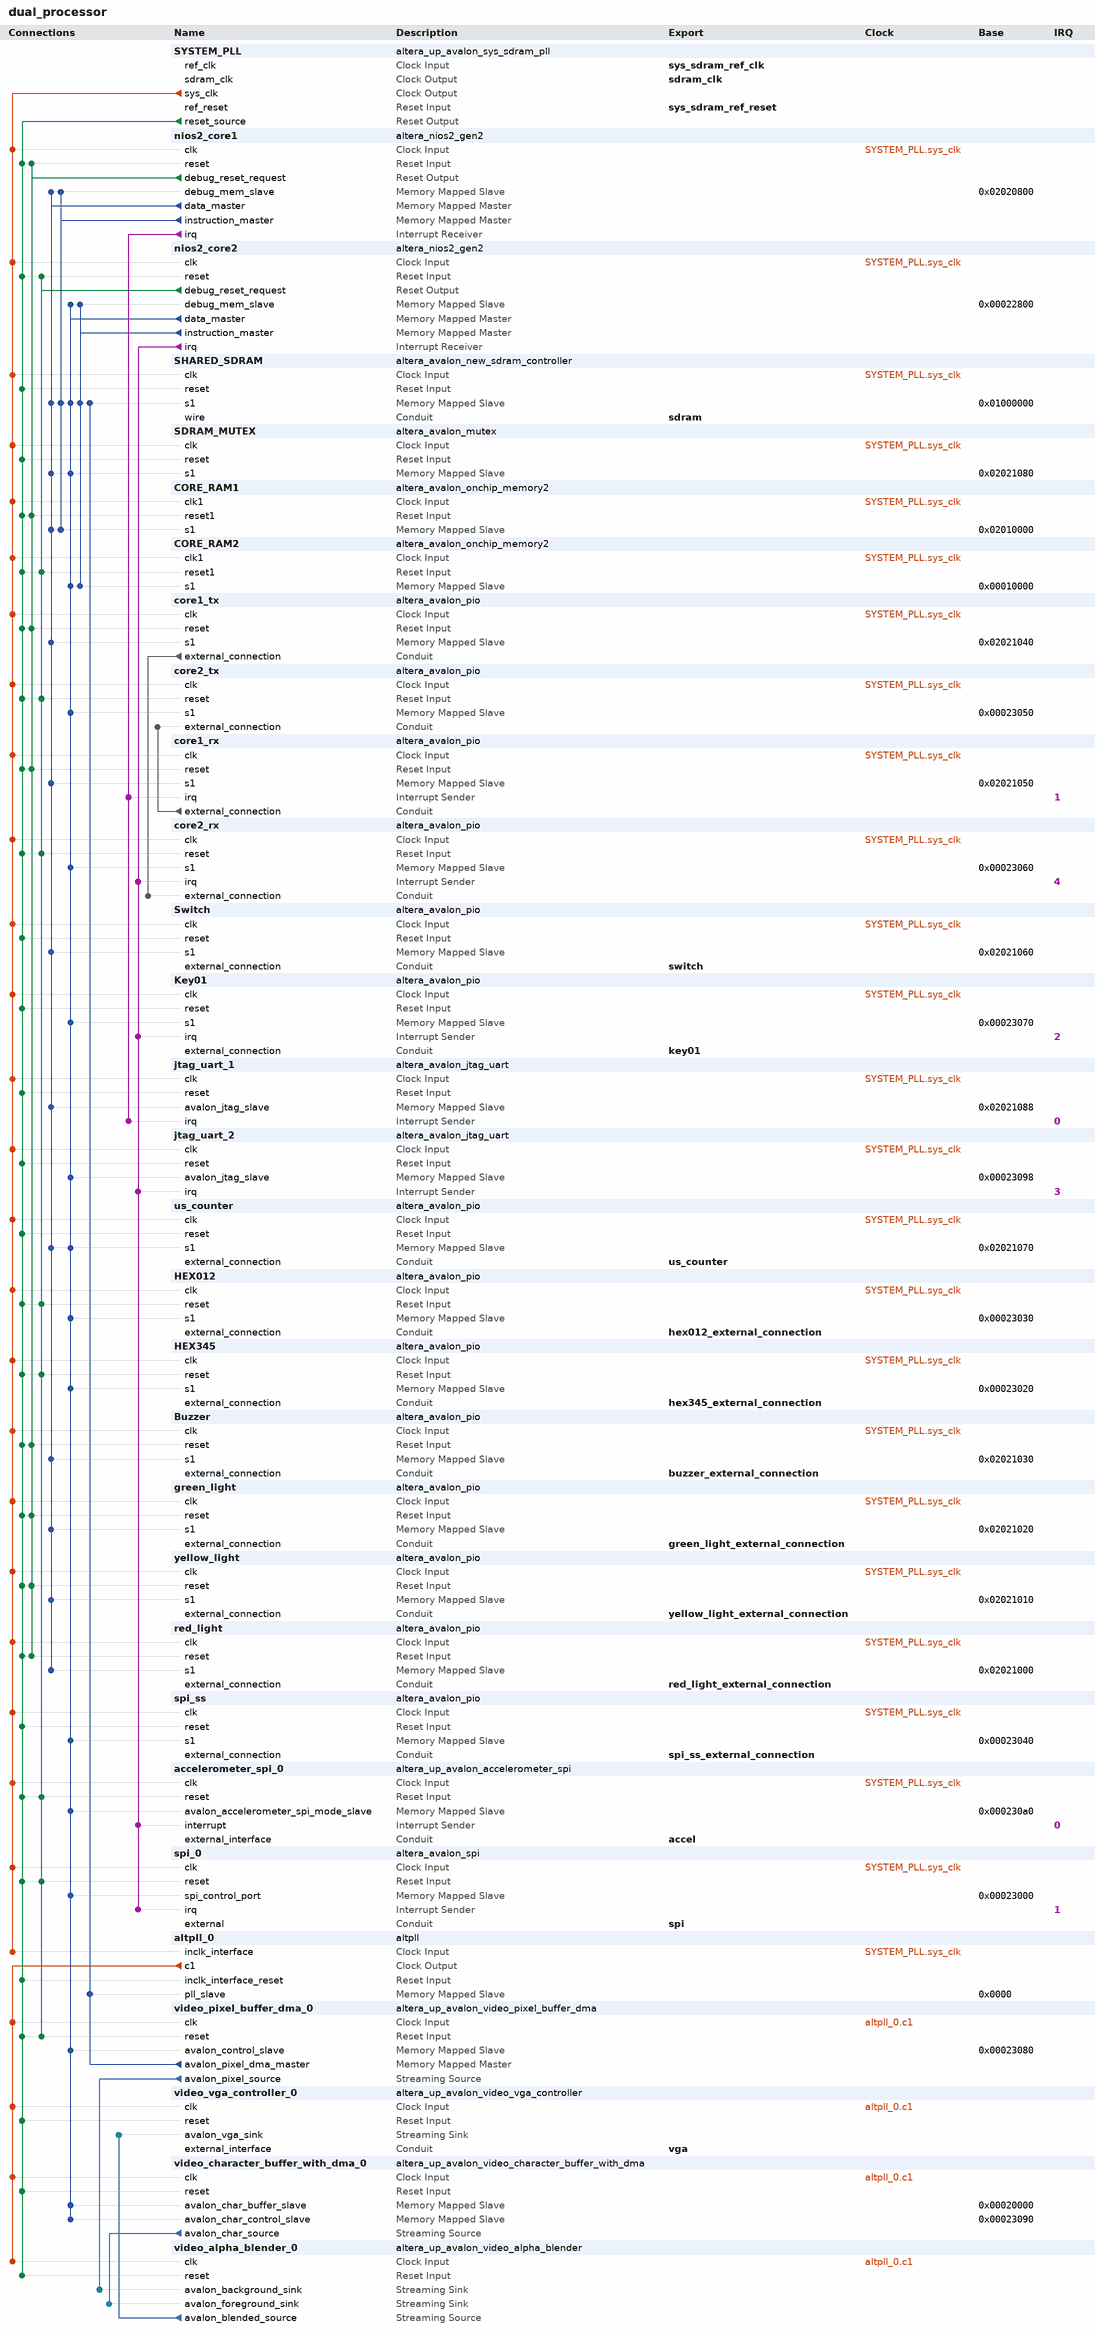
[diagram p0: system contents]
# Platform Designer (Qsys) system dual_processor, MAX 10 10M50DAF484C7G
# Parameters at their usual value, and those the tool derives, are not listed.
package require -exact qsys 18.1
create_system dual_processor
set_project_property DEVICE_FAMILY {MAX 10}
set_project_property DEVICE 10M50DAF484C7G

add_instance SYSTEM_PLL altera_up_avalon_sys_sdram_pll 18.0
set_instance_parameter_value SYSTEM_PLL CV_boards DE10-Standard
set_instance_parameter_value SYSTEM_PLL gui_outclk 50.0
set_instance_parameter_value SYSTEM_PLL gui_refclk 50.0

add_instance nios2_core1 altera_nios2_gen2 18.1
set_instance_parameter_value nios2_core1 dcache_size 2048
set_instance_parameter_value nios2_core1 exceptionSlave CORE_RAM1.s1
set_instance_parameter_value nios2_core1 icache_size 4096
set_instance_parameter_value nios2_core1 impl Fast
set_instance_parameter_value nios2_core1 resetSlave CORE_RAM1.s1

add_instance nios2_core2 altera_nios2_gen2 18.1
set_instance_parameter_value nios2_core2 cpuID 1
set_instance_parameter_value nios2_core2 dcache_size 2048
set_instance_parameter_value nios2_core2 exceptionSlave CORE_RAM2.s1
set_instance_parameter_value nios2_core2 icache_size 4096
set_instance_parameter_value nios2_core2 impl Fast
set_instance_parameter_value nios2_core2 resetSlave CORE_RAM2.s1

add_instance SHARED_SDRAM altera_avalon_new_sdram_controller 18.1
set_instance_parameter_value SHARED_SDRAM TAC 5.5
set_instance_parameter_value SHARED_SDRAM TRCD 20.0
set_instance_parameter_value SHARED_SDRAM TRP 20.0
set_instance_parameter_value SHARED_SDRAM casLatency 3
set_instance_parameter_value SHARED_SDRAM columnWidth 8
set_instance_parameter_value SHARED_SDRAM dataWidth 16
set_instance_parameter_value SHARED_SDRAM generateSimulationModel false
set_instance_parameter_value SHARED_SDRAM model single_Micron_MT48LC4M32B2_7_chip
set_instance_parameter_value SHARED_SDRAM numberOfBanks 4
set_instance_parameter_value SHARED_SDRAM numberOfChipSelects 1
set_instance_parameter_value SHARED_SDRAM powerUpDelay 100.0
set_instance_parameter_value SHARED_SDRAM refreshPeriod 15.625
set_instance_parameter_value SHARED_SDRAM rowWidth 13

add_instance SDRAM_MUTEX altera_avalon_mutex 18.1

add_instance CORE_RAM1 altera_avalon_onchip_memory2 18.1
set_instance_parameter_value CORE_RAM1 dataWidth 32
set_instance_parameter_value CORE_RAM1 dualPort false
set_instance_parameter_value CORE_RAM1 initMemContent true
set_instance_parameter_value CORE_RAM1 initializationFileName onchip_mem.hex
set_instance_parameter_value CORE_RAM1 memorySize 40960

add_instance CORE_RAM2 altera_avalon_onchip_memory2 18.1
set_instance_parameter_value CORE_RAM2 dataWidth 32
set_instance_parameter_value CORE_RAM2 dualPort false
set_instance_parameter_value CORE_RAM2 initMemContent true
set_instance_parameter_value CORE_RAM2 initializationFileName onchip_mem.hex
set_instance_parameter_value CORE_RAM2 memorySize 40960

add_instance core1_tx altera_avalon_pio 18.1
set_instance_parameter_value core1_tx direction Output
set_instance_parameter_value core1_tx width 1

add_instance core2_tx altera_avalon_pio 18.1
set_instance_parameter_value core2_tx direction Output
set_instance_parameter_value core2_tx width 1

add_instance core1_rx altera_avalon_pio 18.1
set_instance_parameter_value core1_rx direction Input
set_instance_parameter_value core1_rx generateIRQ true
set_instance_parameter_value core1_rx width 1

add_instance core2_rx altera_avalon_pio 18.1
set_instance_parameter_value core2_rx direction Input
set_instance_parameter_value core2_rx generateIRQ true
set_instance_parameter_value core2_rx width 1

add_instance Switch altera_avalon_pio 18.1
set_instance_parameter_value Switch direction Input
set_instance_parameter_value Switch width 10

add_instance Key01 altera_avalon_pio 18.1
set_instance_parameter_value Key01 direction Input
set_instance_parameter_value Key01 generateIRQ true
set_instance_parameter_value Key01 width 2

add_instance jtag_uart_1 altera_avalon_jtag_uart 18.1
set_instance_parameter_value jtag_uart_1 simInteractiveOptions NO_INTERACTIVE_WINDOWS

add_instance jtag_uart_2 altera_avalon_jtag_uart 18.1
set_instance_parameter_value jtag_uart_2 simInteractiveOptions NO_INTERACTIVE_WINDOWS

add_instance us_counter altera_avalon_pio 18.1
set_instance_parameter_value us_counter direction Input
set_instance_parameter_value us_counter width 32

add_instance HEX012 altera_avalon_pio 18.1
set_instance_parameter_value HEX012 direction Output
set_instance_parameter_value HEX012 width 24

add_instance HEX345 altera_avalon_pio 18.1
set_instance_parameter_value HEX345 direction Output
set_instance_parameter_value HEX345 width 24

add_instance Buzzer altera_avalon_pio 18.1
set_instance_parameter_value Buzzer direction Output
set_instance_parameter_value Buzzer width 1

add_instance green_light altera_avalon_pio 18.1
set_instance_parameter_value green_light direction Output
set_instance_parameter_value green_light width 1

add_instance yellow_light altera_avalon_pio 18.1
set_instance_parameter_value yellow_light direction Output
set_instance_parameter_value yellow_light width 1

add_instance red_light altera_avalon_pio 18.1
set_instance_parameter_value red_light direction Output
set_instance_parameter_value red_light width 1

add_instance spi_ss altera_avalon_pio 18.1
set_instance_parameter_value spi_ss direction Output
set_instance_parameter_value spi_ss width 1

add_instance accelerometer_spi_0 altera_up_avalon_accelerometer_spi 18.0

add_instance spi_0 altera_avalon_spi 18.1
set_instance_parameter_value spi_0 clockPolarity 0
set_instance_parameter_value spi_0 dataWidth 8
set_instance_parameter_value spi_0 masterSPI true
set_instance_parameter_value spi_0 numberOfSlaves 1
set_instance_parameter_value spi_0 targetClockRate 128000

add_instance altpll_0 altpll 18.1
set_instance_parameter_value altpll_0 CLK0_DIVIDE_BY 1
set_instance_parameter_value altpll_0 CLK0_MULTIPLY_BY 1
set_instance_parameter_value altpll_0 CLK1_DIVIDE_BY 4
set_instance_parameter_value altpll_0 CLK1_DUTY_CYCLE 50
set_instance_parameter_value altpll_0 CLK1_MULTIPLY_BY 1
set_instance_parameter_value altpll_0 CLK1_PHASE_SHIFT 0
set_instance_parameter_value altpll_0 INCLK0_INPUT_FREQUENCY 10000
set_instance_parameter_value altpll_0 PORT_ARESET PORT_UNUSED
set_instance_parameter_value altpll_0 PORT_LOCKED PORT_UNUSED
set_instance_parameter_value altpll_0 PORT_clk1 PORT_USED
set_instance_parameter_value altpll_0 PORT_clk2 PORT_UNUSED
set_instance_parameter_value altpll_0 PORT_clk3 PORT_UNUSED

add_instance video_pixel_buffer_dma_0 altera_up_avalon_video_pixel_buffer_dma 18.0
set_instance_parameter_value video_pixel_buffer_dma_0 addr_mode X-Y
set_instance_parameter_value video_pixel_buffer_dma_0 back_start_address 0
set_instance_parameter_value video_pixel_buffer_dma_0 color_space {30-bit RGB}
set_instance_parameter_value video_pixel_buffer_dma_0 image_height 480
set_instance_parameter_value video_pixel_buffer_dma_0 image_width 640
set_instance_parameter_value video_pixel_buffer_dma_0 start_address 0

add_instance video_vga_controller_0 altera_up_avalon_video_vga_controller 18.1
set_instance_parameter_value video_vga_controller_0 board DE10-Lite
set_instance_parameter_value video_vga_controller_0 resolution {VGA 640x480}

add_instance video_character_buffer_with_dma_0 altera_up_avalon_video_character_buffer_with_dma 18.0
set_instance_parameter_value video_character_buffer_with_dma_0 enable_transparency true

add_instance video_alpha_blender_0 altera_up_avalon_video_alpha_blender 18.0

# connections
add_connection altpll_0.c1 video_alpha_blender_0.clk clock
add_connection altpll_0.c1 video_character_buffer_with_dma_0.clk clock
add_connection altpll_0.c1 video_pixel_buffer_dma_0.clk clock
add_connection altpll_0.c1 video_vga_controller_0.clk clock
add_connection SYSTEM_PLL.sys_clk accelerometer_spi_0.clk clock
add_connection SYSTEM_PLL.sys_clk altpll_0.inclk_interface clock
add_connection SYSTEM_PLL.sys_clk Buzzer.clk clock
add_connection SYSTEM_PLL.sys_clk core1_rx.clk clock
add_connection SYSTEM_PLL.sys_clk core1_tx.clk clock
add_connection SYSTEM_PLL.sys_clk core2_rx.clk clock
add_connection SYSTEM_PLL.sys_clk core2_tx.clk clock
add_connection SYSTEM_PLL.sys_clk CORE_RAM1.clk1 clock
add_connection SYSTEM_PLL.sys_clk CORE_RAM2.clk1 clock
add_connection SYSTEM_PLL.sys_clk green_light.clk clock
add_connection SYSTEM_PLL.sys_clk HEX012.clk clock
add_connection SYSTEM_PLL.sys_clk HEX345.clk clock
add_connection SYSTEM_PLL.sys_clk jtag_uart_1.clk clock
add_connection SYSTEM_PLL.sys_clk jtag_uart_2.clk clock
add_connection SYSTEM_PLL.sys_clk Key01.clk clock
add_connection SYSTEM_PLL.sys_clk nios2_core1.clk clock
add_connection SYSTEM_PLL.sys_clk nios2_core2.clk clock
add_connection SYSTEM_PLL.sys_clk red_light.clk clock
add_connection SYSTEM_PLL.sys_clk SDRAM_MUTEX.clk clock
add_connection SYSTEM_PLL.sys_clk SHARED_SDRAM.clk clock
add_connection SYSTEM_PLL.sys_clk spi_0.clk clock
add_connection SYSTEM_PLL.sys_clk spi_ss.clk clock
add_connection SYSTEM_PLL.sys_clk Switch.clk clock
add_connection SYSTEM_PLL.sys_clk us_counter.clk clock
add_connection SYSTEM_PLL.sys_clk yellow_light.clk clock
add_connection nios2_core1.debug_reset_request Buzzer.reset reset
add_connection nios2_core1.debug_reset_request core1_rx.reset reset
add_connection nios2_core1.debug_reset_request core1_tx.reset reset
add_connection nios2_core1.debug_reset_request CORE_RAM1.reset1 reset
add_connection nios2_core1.debug_reset_request green_light.reset reset
add_connection nios2_core1.debug_reset_request nios2_core1.reset reset
add_connection nios2_core1.debug_reset_request red_light.reset reset
add_connection nios2_core1.debug_reset_request yellow_light.reset reset
add_connection nios2_core2.debug_reset_request accelerometer_spi_0.reset reset
add_connection nios2_core2.debug_reset_request core2_rx.reset reset
add_connection nios2_core2.debug_reset_request core2_tx.reset reset
add_connection nios2_core2.debug_reset_request CORE_RAM2.reset1 reset
add_connection nios2_core2.debug_reset_request HEX012.reset reset
add_connection nios2_core2.debug_reset_request HEX345.reset reset
add_connection nios2_core2.debug_reset_request nios2_core2.reset reset
add_connection nios2_core2.debug_reset_request spi_0.reset reset
add_connection nios2_core2.debug_reset_request video_pixel_buffer_dma_0.reset reset
add_connection SYSTEM_PLL.reset_source accelerometer_spi_0.reset reset
add_connection SYSTEM_PLL.reset_source altpll_0.inclk_interface_reset reset
add_connection SYSTEM_PLL.reset_source Buzzer.reset reset
add_connection SYSTEM_PLL.reset_source core1_rx.reset reset
add_connection SYSTEM_PLL.reset_source core1_tx.reset reset
add_connection SYSTEM_PLL.reset_source core2_rx.reset reset
add_connection SYSTEM_PLL.reset_source core2_tx.reset reset
add_connection SYSTEM_PLL.reset_source CORE_RAM1.reset1 reset
add_connection SYSTEM_PLL.reset_source CORE_RAM2.reset1 reset
add_connection SYSTEM_PLL.reset_source green_light.reset reset
add_connection SYSTEM_PLL.reset_source HEX012.reset reset
add_connection SYSTEM_PLL.reset_source HEX345.reset reset
add_connection SYSTEM_PLL.reset_source jtag_uart_1.reset reset
add_connection SYSTEM_PLL.reset_source jtag_uart_2.reset reset
add_connection SYSTEM_PLL.reset_source Key01.reset reset
add_connection SYSTEM_PLL.reset_source nios2_core1.reset reset
add_connection SYSTEM_PLL.reset_source nios2_core2.reset reset
add_connection SYSTEM_PLL.reset_source red_light.reset reset
add_connection SYSTEM_PLL.reset_source SDRAM_MUTEX.reset reset
add_connection SYSTEM_PLL.reset_source SHARED_SDRAM.reset reset
add_connection SYSTEM_PLL.reset_source spi_0.reset reset
add_connection SYSTEM_PLL.reset_source spi_ss.reset reset
add_connection SYSTEM_PLL.reset_source Switch.reset reset
add_connection SYSTEM_PLL.reset_source us_counter.reset reset
add_connection SYSTEM_PLL.reset_source video_alpha_blender_0.reset reset
add_connection SYSTEM_PLL.reset_source video_character_buffer_with_dma_0.reset reset
add_connection SYSTEM_PLL.reset_source video_pixel_buffer_dma_0.reset reset
add_connection SYSTEM_PLL.reset_source video_vga_controller_0.reset reset
add_connection SYSTEM_PLL.reset_source yellow_light.reset reset
add_connection nios2_core1.data_master Buzzer.s1 avalon
set_connection_parameter_value nios2_core1.data_master/Buzzer.s1 baseAddress 0x02021030
add_connection nios2_core1.data_master core1_rx.s1 avalon
set_connection_parameter_value nios2_core1.data_master/core1_rx.s1 baseAddress 0x02021050
add_connection nios2_core1.data_master core1_tx.s1 avalon
set_connection_parameter_value nios2_core1.data_master/core1_tx.s1 baseAddress 0x02021040
add_connection nios2_core1.data_master CORE_RAM1.s1 avalon
set_connection_parameter_value nios2_core1.data_master/CORE_RAM1.s1 baseAddress 0x02010000
add_connection nios2_core1.data_master green_light.s1 avalon
set_connection_parameter_value nios2_core1.data_master/green_light.s1 baseAddress 0x02021020
add_connection nios2_core1.data_master jtag_uart_1.avalon_jtag_slave avalon
set_connection_parameter_value nios2_core1.data_master/jtag_uart_1.avalon_jtag_slave baseAddress 0x02021088
add_connection nios2_core1.data_master nios2_core1.debug_mem_slave avalon
set_connection_parameter_value nios2_core1.data_master/nios2_core1.debug_mem_slave baseAddress 0x02020800
add_connection nios2_core1.data_master red_light.s1 avalon
set_connection_parameter_value nios2_core1.data_master/red_light.s1 baseAddress 0x02021000
add_connection nios2_core1.data_master SDRAM_MUTEX.s1 avalon
set_connection_parameter_value nios2_core1.data_master/SDRAM_MUTEX.s1 baseAddress 0x02021080
add_connection nios2_core1.data_master SHARED_SDRAM.s1 avalon
set_connection_parameter_value nios2_core1.data_master/SHARED_SDRAM.s1 baseAddress 0x01000000
add_connection nios2_core1.data_master Switch.s1 avalon
set_connection_parameter_value nios2_core1.data_master/Switch.s1 baseAddress 0x02021060
add_connection nios2_core1.data_master us_counter.s1 avalon
set_connection_parameter_value nios2_core1.data_master/us_counter.s1 baseAddress 0x02021070
add_connection nios2_core1.data_master yellow_light.s1 avalon
set_connection_parameter_value nios2_core1.data_master/yellow_light.s1 baseAddress 0x02021010
add_connection nios2_core1.instruction_master CORE_RAM1.s1 avalon
set_connection_parameter_value nios2_core1.instruction_master/CORE_RAM1.s1 baseAddress 0x02010000
add_connection nios2_core1.instruction_master nios2_core1.debug_mem_slave avalon
set_connection_parameter_value nios2_core1.instruction_master/nios2_core1.debug_mem_slave baseAddress 0x02020800
add_connection nios2_core1.instruction_master SHARED_SDRAM.s1 avalon
set_connection_parameter_value nios2_core1.instruction_master/SHARED_SDRAM.s1 baseAddress 0x01000000
add_connection nios2_core2.data_master accelerometer_spi_0.avalon_accelerometer_spi_mode_slave avalon
set_connection_parameter_value nios2_core2.data_master/accelerometer_spi_0.avalon_accelerometer_spi_mode_slave baseAddress 0x000230a0
add_connection nios2_core2.data_master core2_rx.s1 avalon
set_connection_parameter_value nios2_core2.data_master/core2_rx.s1 baseAddress 0x00023060
add_connection nios2_core2.data_master core2_tx.s1 avalon
set_connection_parameter_value nios2_core2.data_master/core2_tx.s1 baseAddress 0x00023050
add_connection nios2_core2.data_master CORE_RAM2.s1 avalon
set_connection_parameter_value nios2_core2.data_master/CORE_RAM2.s1 baseAddress 0x00010000
add_connection nios2_core2.data_master HEX012.s1 avalon
set_connection_parameter_value nios2_core2.data_master/HEX012.s1 baseAddress 0x00023030
add_connection nios2_core2.data_master HEX345.s1 avalon
set_connection_parameter_value nios2_core2.data_master/HEX345.s1 baseAddress 0x00023020
add_connection nios2_core2.data_master jtag_uart_2.avalon_jtag_slave avalon
set_connection_parameter_value nios2_core2.data_master/jtag_uart_2.avalon_jtag_slave baseAddress 0x00023098
add_connection nios2_core2.data_master Key01.s1 avalon
set_connection_parameter_value nios2_core2.data_master/Key01.s1 baseAddress 0x00023070
add_connection nios2_core2.data_master nios2_core2.debug_mem_slave avalon
set_connection_parameter_value nios2_core2.data_master/nios2_core2.debug_mem_slave baseAddress 0x00022800
add_connection nios2_core2.data_master SDRAM_MUTEX.s1 avalon
set_connection_parameter_value nios2_core2.data_master/SDRAM_MUTEX.s1 baseAddress 0x02021080
add_connection nios2_core2.data_master SHARED_SDRAM.s1 avalon
set_connection_parameter_value nios2_core2.data_master/SHARED_SDRAM.s1 baseAddress 0x01000000
add_connection nios2_core2.data_master spi_0.spi_control_port avalon
set_connection_parameter_value nios2_core2.data_master/spi_0.spi_control_port baseAddress 0x00023000
add_connection nios2_core2.data_master spi_ss.s1 avalon
set_connection_parameter_value nios2_core2.data_master/spi_ss.s1 baseAddress 0x00023040
add_connection nios2_core2.data_master us_counter.s1 avalon
set_connection_parameter_value nios2_core2.data_master/us_counter.s1 baseAddress 0x02021070
add_connection nios2_core2.data_master video_character_buffer_with_dma_0.avalon_char_buffer_slave avalon
set_connection_parameter_value nios2_core2.data_master/video_character_buffer_with_dma_0.avalon_char_buffer_slave baseAddress 0x00020000
add_connection nios2_core2.data_master video_character_buffer_with_dma_0.avalon_char_control_slave avalon
set_connection_parameter_value nios2_core2.data_master/video_character_buffer_with_dma_0.avalon_char_control_slave baseAddress 0x00023090
add_connection nios2_core2.data_master video_pixel_buffer_dma_0.avalon_control_slave avalon
set_connection_parameter_value nios2_core2.data_master/video_pixel_buffer_dma_0.avalon_control_slave baseAddress 0x00023080
add_connection nios2_core2.instruction_master CORE_RAM2.s1 avalon
set_connection_parameter_value nios2_core2.instruction_master/CORE_RAM2.s1 baseAddress 0x00010000
add_connection nios2_core2.instruction_master nios2_core2.debug_mem_slave avalon
set_connection_parameter_value nios2_core2.instruction_master/nios2_core2.debug_mem_slave baseAddress 0x00022800
add_connection nios2_core2.instruction_master SHARED_SDRAM.s1 avalon
set_connection_parameter_value nios2_core2.instruction_master/SHARED_SDRAM.s1 baseAddress 0x01000000
add_connection video_pixel_buffer_dma_0.avalon_pixel_dma_master altpll_0.pll_slave avalon
set_connection_parameter_value video_pixel_buffer_dma_0.avalon_pixel_dma_master/altpll_0.pll_slave baseAddress 0x0000
add_connection video_pixel_buffer_dma_0.avalon_pixel_dma_master SHARED_SDRAM.s1 avalon
set_connection_parameter_value video_pixel_buffer_dma_0.avalon_pixel_dma_master/SHARED_SDRAM.s1 baseAddress 0x01000000
add_connection video_alpha_blender_0.avalon_blended_source video_vga_controller_0.avalon_vga_sink avalon_streaming
add_connection video_character_buffer_with_dma_0.avalon_char_source video_alpha_blender_0.avalon_foreground_sink avalon_streaming
add_connection video_pixel_buffer_dma_0.avalon_pixel_source video_alpha_blender_0.avalon_background_sink avalon_streaming
add_connection core1_rx.external_connection core2_tx.external_connection conduit
add_connection core1_tx.external_connection core2_rx.external_connection conduit
add_connection nios2_core1.irq core1_rx.irq interrupt
set_connection_parameter_value nios2_core1.irq/core1_rx.irq irqNumber 1
add_connection nios2_core1.irq jtag_uart_1.irq interrupt
set_connection_parameter_value nios2_core1.irq/jtag_uart_1.irq irqNumber 0
add_connection nios2_core2.irq accelerometer_spi_0.interrupt interrupt
set_connection_parameter_value nios2_core2.irq/accelerometer_spi_0.interrupt irqNumber 0
add_connection nios2_core2.irq core2_rx.irq interrupt
set_connection_parameter_value nios2_core2.irq/core2_rx.irq irqNumber 4
add_connection nios2_core2.irq jtag_uart_2.irq interrupt
set_connection_parameter_value nios2_core2.irq/jtag_uart_2.irq irqNumber 3
add_connection nios2_core2.irq Key01.irq interrupt
set_connection_parameter_value nios2_core2.irq/Key01.irq irqNumber 2
add_connection nios2_core2.irq spi_0.irq interrupt
set_connection_parameter_value nios2_core2.irq/spi_0.irq irqNumber 1

# exported interfaces
add_interface accel conduit end
set_interface_property accel EXPORT_OF accelerometer_spi_0.external_interface
add_interface buzzer_external_connection conduit end
set_interface_property buzzer_external_connection EXPORT_OF Buzzer.external_connection
add_interface green_light_external_connection conduit end
set_interface_property green_light_external_connection EXPORT_OF green_light.external_connection
add_interface hex012_external_connection conduit end
set_interface_property hex012_external_connection EXPORT_OF HEX012.external_connection
add_interface hex345_external_connection conduit end
set_interface_property hex345_external_connection EXPORT_OF HEX345.external_connection
add_interface key01 conduit end
set_interface_property key01 EXPORT_OF Key01.external_connection
add_interface red_light_external_connection conduit end
set_interface_property red_light_external_connection EXPORT_OF red_light.external_connection
add_interface sdram conduit end
set_interface_property sdram EXPORT_OF SHARED_SDRAM.wire
add_interface sdram_clk clock source
set_interface_property sdram_clk EXPORT_OF SYSTEM_PLL.sdram_clk
add_interface spi conduit end
set_interface_property spi EXPORT_OF spi_0.external
add_interface spi_ss_external_connection conduit end
set_interface_property spi_ss_external_connection EXPORT_OF spi_ss.external_connection
add_interface switch conduit end
set_interface_property switch EXPORT_OF Switch.external_connection
add_interface sys_sdram_ref_clk clock sink
set_interface_property sys_sdram_ref_clk EXPORT_OF SYSTEM_PLL.ref_clk
add_interface sys_sdram_ref_reset reset sink
set_interface_property sys_sdram_ref_reset EXPORT_OF SYSTEM_PLL.ref_reset
add_interface us_counter conduit end
set_interface_property us_counter EXPORT_OF us_counter.external_connection
add_interface vga conduit end
set_interface_property vga EXPORT_OF video_vga_controller_0.external_interface
add_interface yellow_light_external_connection conduit end
set_interface_property yellow_light_external_connection EXPORT_OF yellow_light.external_connection

set_interconnect_requirement {$system} qsys_mm.clockCrossingAdapter HANDSHAKE
set_interconnect_requirement {$system} qsys_mm.enableEccProtection FALSE
set_interconnect_requirement {$system} qsys_mm.insertDefaultSlave FALSE
set_interconnect_requirement {$system} qsys_mm.maxAdditionalLatency 1

save_system dual_processor.qsys
